# EAGLE schematic MIDI Decoder (EAGLE 9.6.2)
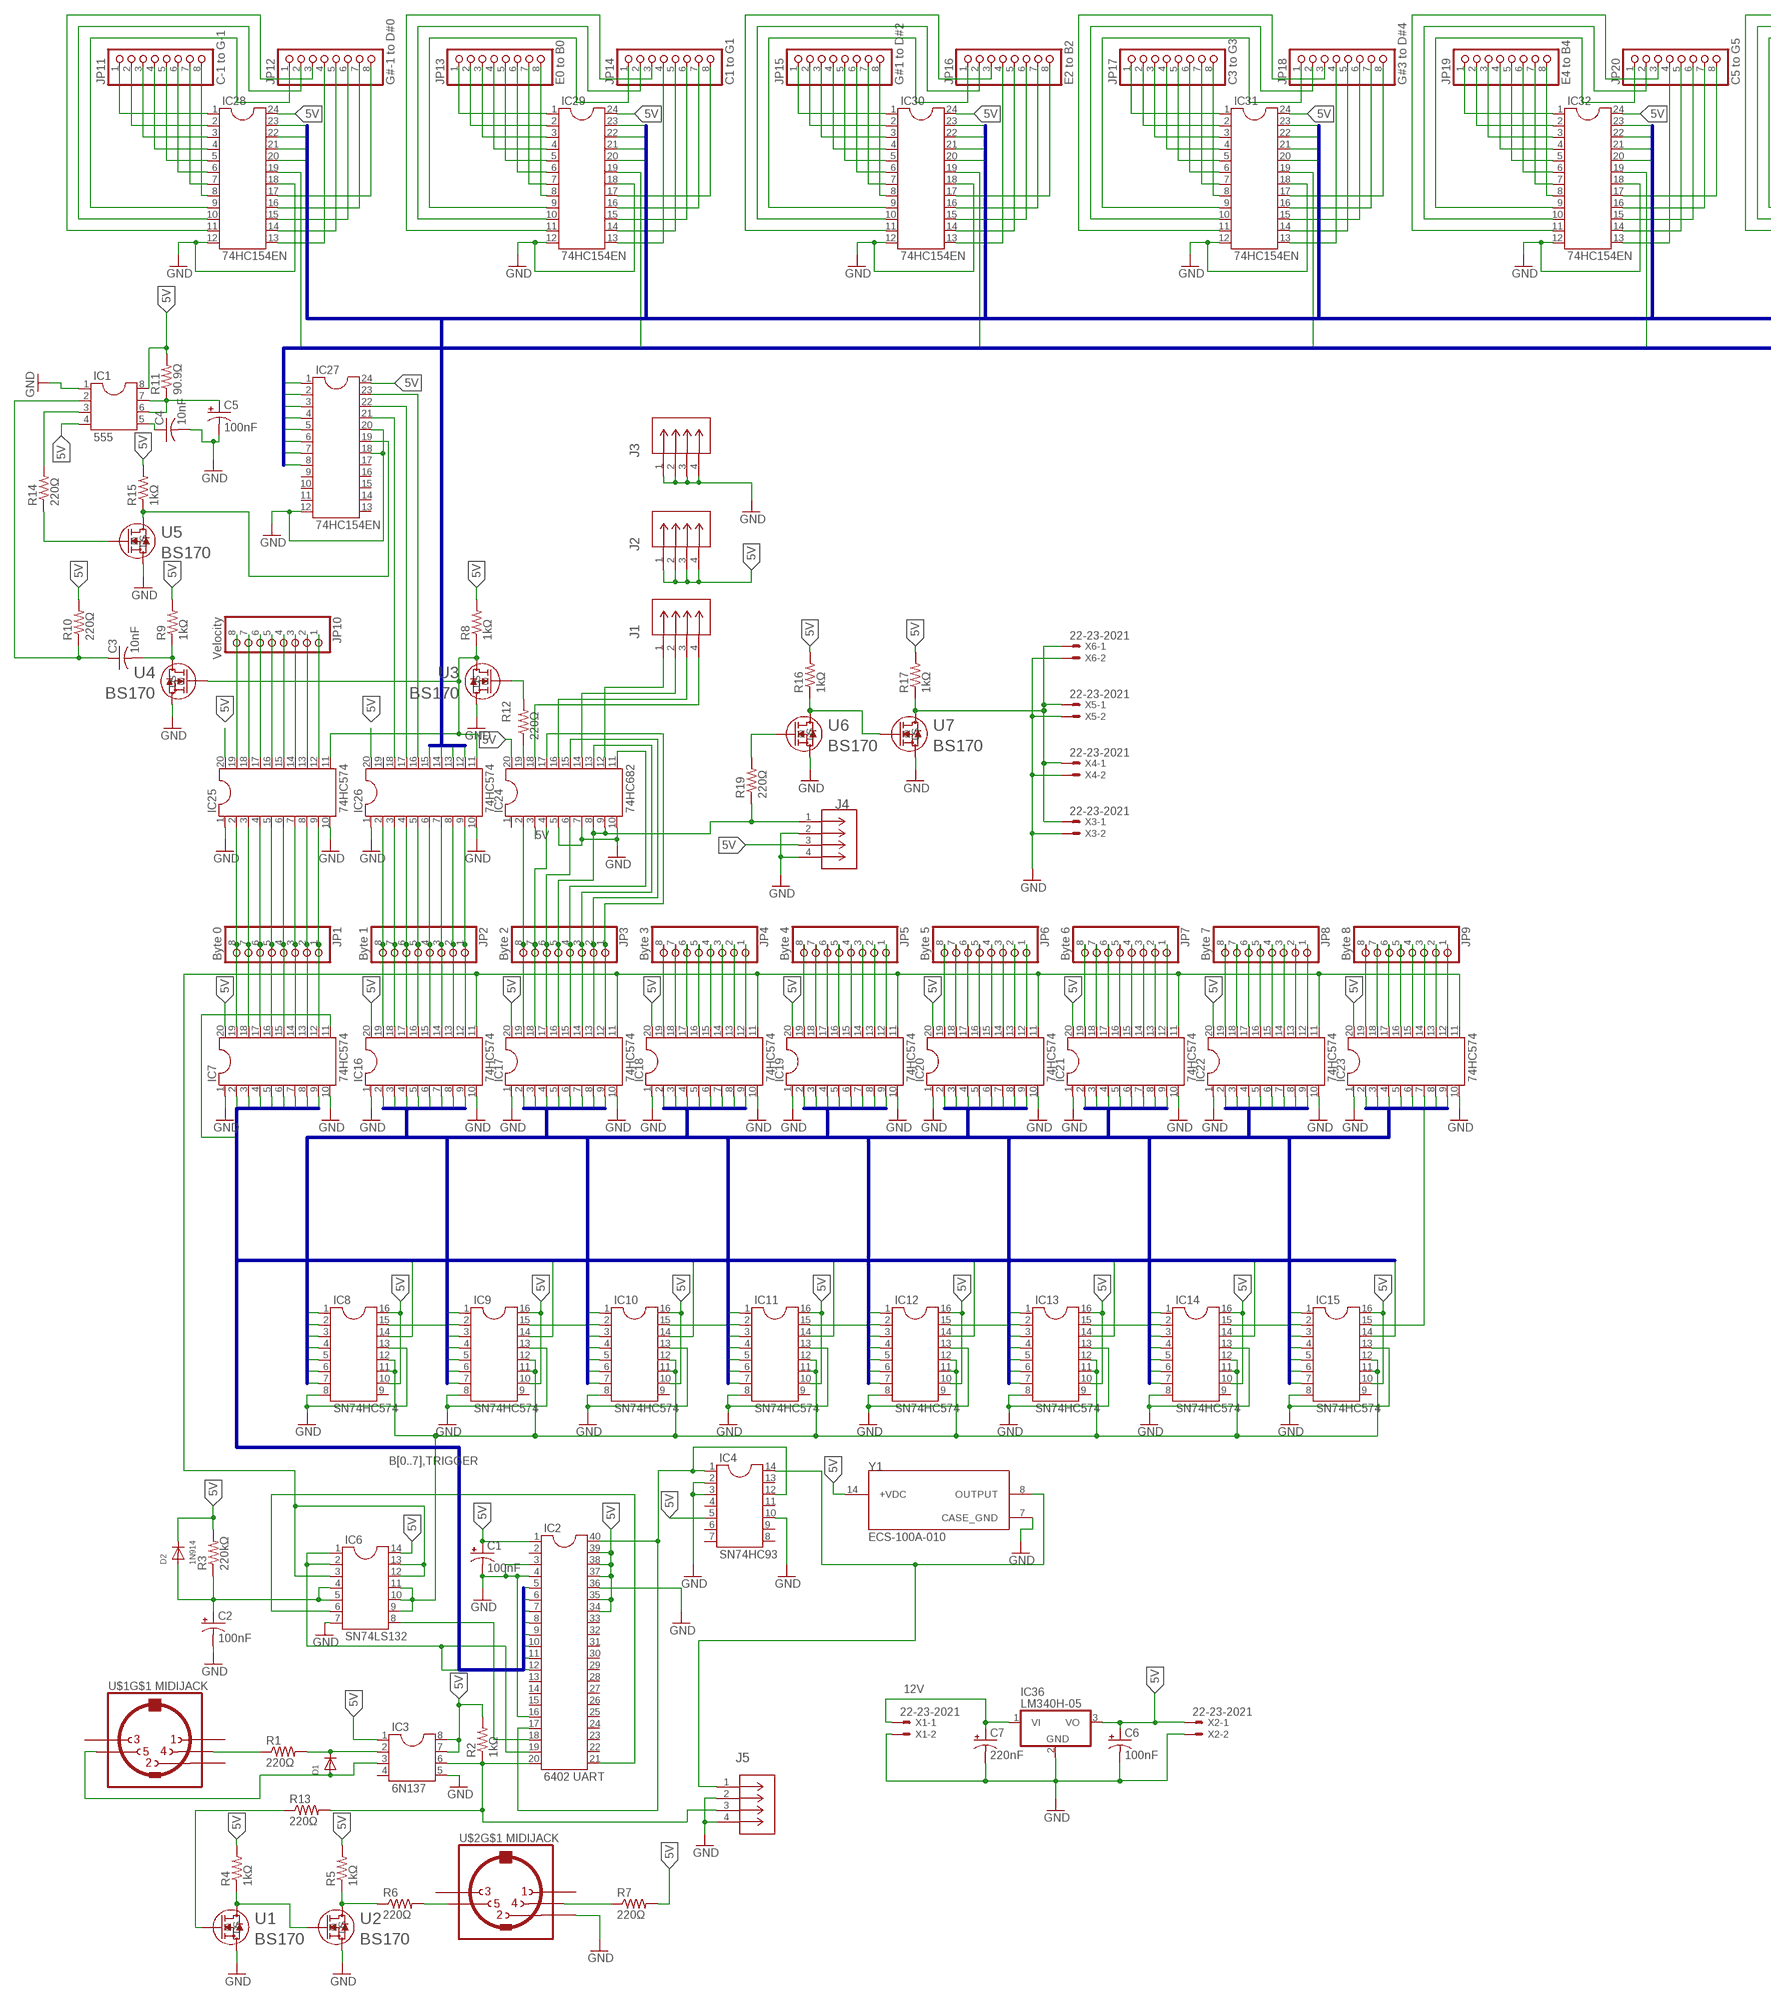
[diagram p0: schematic, sheet 1, part 1 of 2]
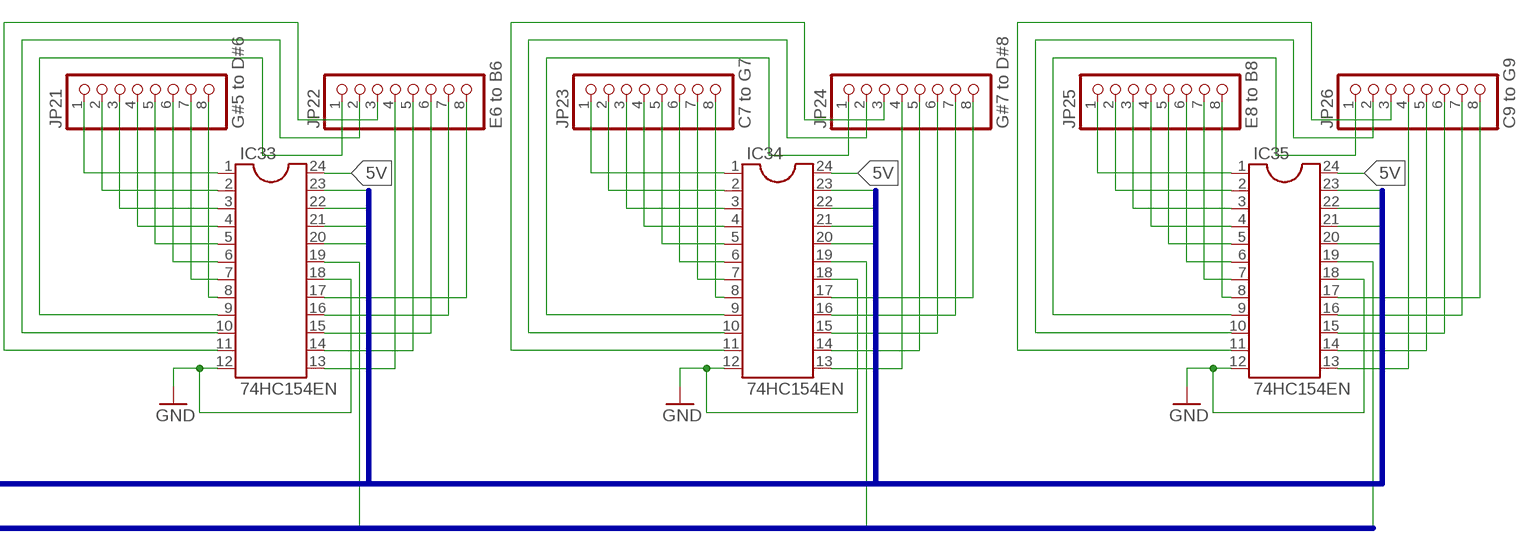
[diagram p1: schematic, sheet 1, part 2 of 2]

## Parts
C1  100nF  CPOL-USE1.8-4  [E1,8-4]
C2  100nF  CPOL-USE1.8-4  [E1,8-4]
C3  10nF  C-US050-025X075  [C050-025X075]
C4  10nF  C-US050-025X075  [C050-025X075]
C5  100nF  CPOL-USE1.8-4  [E1,8-4]
C6  100nF  CPOL-USE1.8-4  [E1,8-4]
C7  220nF  CPOL-USE2-5  [E2-5]
D1  DIODEDO-1N4148  [DO-1N4148]
D2  1N914  DIODEDO-1N4148  [DO-1N4148]
IC1  555  DIL8S  [SOCKET-08]
IC2  6402 UART  DIL40S  [SOCKET-40]
IC3  6N137  DIL8S  [SOCKET-08]
IC4  SN74HC93  DIL14S  [SOCKET-14]
IC6  SN74LS132  DIL14S  [SOCKET-14]
IC7  74HC574  DIL20S  [SOCKET-20]
IC8  SN74HC574  DIL16S  [SOCKET-16]
IC9  SN74HC574  DIL16S  [SOCKET-16]
IC10  SN74HC574  DIL16S  [SOCKET-16]
IC11  SN74HC574  DIL16S  [SOCKET-16]
IC12  SN74HC574  DIL16S  [SOCKET-16]
IC13  SN74HC574  DIL16S  [SOCKET-16]
IC14  SN74HC574  DIL16S  [SOCKET-16]
IC15  SN74HC574  DIL16S  [SOCKET-16]
IC16  74HC574  DIL20S  [SOCKET-20]
IC17  74HC574  DIL20S  [SOCKET-20]
IC18  74HC574  DIL20S  [SOCKET-20]
IC19  74HC574  DIL20S  [SOCKET-20]
IC20  74HC574  DIL20S  [SOCKET-20]
IC21  74HC574  DIL20S  [SOCKET-20]
IC22  74HC574  DIL20S  [SOCKET-20]
IC23  74HC574  DIL20S  [SOCKET-20]
IC24  74HC682  DIL20S  [SOCKET-20]
IC25  74HC574  DIL20S  [SOCKET-20]
IC26  74HC574  DIL20S  [SOCKET-20]
IC27  74HC154EN  DIL24S-3  [SOCKET-24S]
IC28  74HC154EN  DIL24S-3  [SOCKET-24S]
IC29  74HC154EN  DIL24S-3  [SOCKET-24S]
IC30  74HC154EN  DIL24S-3  [SOCKET-24S]
IC31  74HC154EN  DIL24S-3  [SOCKET-24S]
IC32  74HC154EN  DIL24S-3  [SOCKET-24S]
IC33  74HC154EN  DIL24S-3  [SOCKET-24S]
IC34  74HC154EN  DIL24S-3  [SOCKET-24S]
IC35  74HC154EN  DIL24S-3  [SOCKET-24S]
IC36  LM340H-05  [TO220H]
J1  61300411121  [CONN_61300411121_WRE]
J2  61300411121  [CONN_61300411121_WRE]
J3  61300411121  [CONN_61300411121_WRE]
J4  61300411121  [CONN_61300411121_WRE]
J5  61300411121  [CONN_61300411121_WRE]
JP1  Byte 0  PINHD-1X8BIG  [1X08-BIG]
JP2  Byte 1  PINHD-1X8BIG  [1X08-BIG]
JP3  Byte 2  PINHD-1X8BIG  [1X08-BIG]
JP4  Byte 3  PINHD-1X8BIG  [1X08-BIG]
JP5  Byte 4  PINHD-1X8BIG  [1X08-BIG]
JP6  Byte 5  PINHD-1X8BIG  [1X08-BIG]
JP7  Byte 6  PINHD-1X8BIG  [1X08-BIG]
JP8  Byte 7  PINHD-1X8BIG  [1X08-BIG]
JP9  Byte 8  PINHD-1X8BIG  [1X08-BIG]
JP10  Velocity  PINHD-1X8BIG  [1X08-BIG]
JP11  C-1 to G-1  PINHD-1X8BIG  [1X08-BIG]
JP12  G#-1 to D#0  PINHD-1X8BIG  [1X08-BIG]
JP13  E0 to B0  PINHD-1X8BIG  [1X08-BIG]
JP14  C1 to G1  PINHD-1X8BIG  [1X08-BIG]
JP15  G#1 to D#2  PINHD-1X8BIG  [1X08-BIG]
JP16  E2 to B2  PINHD-1X8BIG  [1X08-BIG]
JP17  C3 to G3  PINHD-1X8BIG  [1X08-BIG]
JP18  G#3 to D#4  PINHD-1X8BIG  [1X08-BIG]
JP19  E4 to B4  PINHD-1X8BIG  [1X08-BIG]
JP20  C5 to G5  PINHD-1X8BIG  [1X08-BIG]
JP21  G#5 to D#6  PINHD-1X8BIG  [1X08-BIG]
JP22  E6 to B6  PINHD-1X8BIG  [1X08-BIG]
JP23  C7 to G7  PINHD-1X8BIG  [1X08-BIG]
JP24  G#7 to D#8  PINHD-1X8BIG  [1X08-BIG]
JP25  E8 to B8  PINHD-1X8BIG  [1X08-BIG]
JP26  C9 to G9  PINHD-1X8BIG  [1X08-BIG]
R1  220Ω  R-US_0207/10  [0207/10]
R2  1kΩ  R-US_0207/10  [0207/10]
R3  220kΩ  R-US_0207/10  [0207/10]
R4  1kΩ  R-US_0207/10  [0207/10]
R5  1kΩ  R-US_0207/10  [0207/10]
R6  220Ω  R-US_0207/10  [0207/10]
R7  220Ω  R-US_0207/10  [0207/10]
R8  1kΩ  R-US_0207/10  [0207/10]
R9  1kΩ  R-US_0207/10  [0207/10]
R10  220Ω  R-US_0207/10  [0207/10]
R11  90.9Ω  R-US_0207/10  [0207/10]
R12  220Ω  R-US_0207/10  [0207/10]
R13  220Ω  R-US_0207/10  [0207/10]
R14  220Ω  R-US_0207/10  [0207/10]
R15  1kΩ  R-US_0207/10  [0207/10]
R16  1kΩ  R-US_0207/10  [0207/10]
R17  1kΩ  R-US_0207/10  [0207/10]
R19  220Ω  R-US_0207/10  [0207/10]
U1  BS170  [TO_SA06_ONS]
U2  BS170  [TO_SA06_ONS]
U3  BS170  [TO_SA06_ONS]
U4  BS170  [TO_SA06_ONS]
U5  BS170  [TO_SA06_ONS]
U6  BS170  [TO_SA06_ONS]
U7  BS170  [TO_SA06_ONS]
U$1  MIDIJACK  [CP-2350]
U$2  MIDIJACK  [CP-2350]
X1  22-23-2021  [22-23-2021]
X2  22-23-2021  [22-23-2021]
X3  22-23-2021  [22-23-2021]
X4  22-23-2021  [22-23-2021]
X5  22-23-2021  [22-23-2021]
X6  22-23-2021  [22-23-2021]
Y1  ECS-100A-010  [OSC_ECS-100A-010]

## Nets
5V: C1.+ C6.+ D2.C IC1.4 IC1.8 IC2.1 IC2.34 IC2.35 IC2.37 IC2.38 IC2.39 IC3.1 IC3.7 IC3.8 IC4.5 IC6.14 IC7.20 IC8.10 IC8.16 IC9.10 IC9.16 IC10.10 IC10.16 IC11.10 IC11.16 IC12.10 IC12.16 IC13.10 IC13.16 IC14.10 IC14.16 IC15.10 IC15.16 IC16.20 IC17.20 IC18.20 IC19.20 IC20.20 IC21.20 IC22.20 IC23.20 IC24.3 IC24.20 IC25.20 IC26.20 IC27.24 IC28.24 IC29.24 IC30.24 IC31.24 IC32.24 IC33.24 IC34.24 IC35.24 IC36.3(VO) J2.1 J2.2 J2.3 J2.4 J4.3 R2.2 R3.2 R4.2 R5.2 R7.2 R8.2 R9.2 R10.2 R11.2 R15.2 R16.2 R17.2 X2.1 Y1.14(+VDC)
12V: C7.+ IC36.1(VI) X1.1
B0: IC2.5 IC7.2 IC8.14
B1: IC2.6 IC7.3 IC9.14
B2: IC2.7 IC7.4 IC10.14
B3: IC2.8 IC7.5 IC11.14
B4: IC2.9 IC7.6 IC12.14
B5: IC2.10 IC7.7 IC13.14
B6: IC2.11 IC7.8 IC14.14
B7: IC2.12 IC7.9 IC15.14
CHS0: IC27.1 IC28.19
CHS1: IC27.2 IC29.19
CHS2: IC27.3 IC30.19
CHS3: IC27.4 IC31.19
CHS4: IC27.5 IC32.19
CHS5: IC27.6 IC33.19
CHS6: IC27.7 IC34.19
CHS7: IC27.8 IC35.19
GND: C1.- C2.- C4.2 C5.- C6.- C7.- IC1.1 IC2.3 IC2.4 IC2.16 IC2.36 IC3.5 IC4.2 IC4.3 IC4.10 IC6.7 IC7.1 IC7.10 IC8.8 IC8.13 IC9.8 IC9.13 IC10.8 IC10.13 IC11.8 IC11.13 IC12.8 IC12.13 IC13.8 IC13.13 IC14.8 IC14.13 IC15.8 IC15.13 IC16.1 IC16.10 IC17.1 IC17.10 IC18.1 IC18.10 IC19.1 IC19.10 IC20.1 IC20.10 IC21.1 IC21.10 IC22.1 IC22.10 IC23.1 IC23.10 IC24.5 IC24.7 IC24.10 IC25.1 IC25.10 IC26.1 IC26.10 IC27.12 IC27.18 IC27.20 IC28.12 IC28.18 IC29.12 IC29.18 IC30.12 IC30.18 IC31.12 IC31.18 IC32.12 IC32.18 IC33.12 IC33.18 IC34.12 IC34.18 IC35.12 IC35.18 IC36.2(GND) J3.1 J3.2 J3.3 J3.4 J4.2 J4.4 J5.2 J5.4 U1.3(S) U2.3(S) U3.3(S) U4.3(S) U5.3(S) U6.3(S) U7.3(S) U$2.2 X1.2 X2.2 X3.2 X4.2 X5.2 X6.2 Y1.7(CASE_GND)
N$1: D1.A IC3.3 U$1.5
N$2: D1.C IC3.2 R1.2
N$3: IC2.20 IC3.6 J5.3 R2.1 R13.2
N$4: R1.1 U$1.4
N$5: IC2.17 IC2.40 IC4.1 IC4.12
N$6: C3.1 IC1.2 R10.1
N$7: C5.+ IC1.6 IC1.7 R11.1
N$8: IC4.14 J5.1 Y1.8(OUTPUT)
N$9: IC24.19 R12.1
N$10: R4.1 U1.1(D) U2.2(G)
N$11: C4.1 IC1.5
N$12: IC7.19 IC25.2 JP1.8
N$13: IC2.18 IC6.8
N$14: IC6.3 IC6.12 IC6.13 IC16.11 IC17.11 IC18.11 IC19.11 IC20.11 IC21.11 IC22.11 IC23.11
N$15: IC1.3 R14.2
N$16: IC2.21 IC6.6
N$17: C2.+ D2.A IC6.4 IC6.5 R3.1
N$18: R14.1 U5.2(G)
N$19: R6.2 U$2.5
N$20: R5.1 R6.1 U2.1(D)
N$21: R7.1 U$2.4
N$22: R13.1 U1.2(G)
N$23: IC24.12 J1.1
N$25: R16.1 U6.1(D) U7.2(G)
N$26: IC27.19 R15.1 U5.1(D)
N$27: R17.1 U7.1(D) X3.1 X4.1 X5.1 X6.1
N$29: R19.2 U6.2(G)
N$33: IC6.9 IC6.10 IC6.11 IC8.11 IC8.12 IC9.11 IC9.12 IC10.11 IC10.12 IC11.11 IC11.12 IC12.11 IC12.12 IC13.11 IC13.12 IC14.11 IC14.12 IC15.11 IC15.12
N$42: IC7.18 IC25.3 JP1.7
N$43: IC7.17 IC25.4 JP1.6
N$44: IC7.16 IC25.5 JP1.5
N$45: IC7.15 IC25.6 JP1.4
N$46: IC7.14 IC25.7 JP1.3
N$47: IC7.13 IC25.8 JP1.2
N$48: IC7.12 IC25.9 JP1.1
N$49: IC16.19 IC26.2 JP2.8
N$50: IC16.18 IC26.3 JP2.7
N$51: IC16.17 IC26.4 JP2.6
N$52: IC16.16 IC26.5 JP2.5
N$53: IC16.15 IC26.6 JP2.4
N$54: IC16.14 IC26.7 JP2.3
N$55: IC16.13 IC26.8 JP2.2
N$56: IC16.12 IC26.9 JP2.1
N$57: IC24.14 J1.2
N$58: IC24.16 J1.3
N$59: IC24.18 J1.4
N$60: R12.2 U3.2(G)
N$61: IC25.11 IC26.11 R8.1 U3.1(D) U4.2(G)
N$62: IC25.19 JP10.8
N$63: C3.2 R9.1 U4.1(D)
N$64: IC25.18 JP10.7
N$65: IC18.19 JP4.8
N$66: IC18.18 JP4.7
N$67: IC18.17 JP4.6
N$68: IC18.16 JP4.5
N$69: IC18.15 JP4.4
N$70: IC18.14 JP4.3
N$71: IC18.13 JP4.2
N$72: IC18.12 JP4.1
N$73: IC19.19 JP5.8
N$74: IC19.18 JP5.7
N$75: IC19.17 JP5.6
N$76: IC19.16 JP5.5
N$77: IC19.15 JP5.4
N$78: IC19.14 JP5.3
N$79: IC19.13 JP5.2
N$80: IC19.12 JP5.1
N$81: IC20.19 JP6.8
N$82: IC20.18 JP6.7
N$83: IC20.17 JP6.6
N$84: IC20.16 JP6.5
N$85: IC20.15 JP6.4
N$86: IC20.14 JP6.3
N$87: IC20.13 JP6.2
N$88: IC20.12 JP6.1
N$89: IC21.19 JP7.8
N$90: IC21.18 JP7.7
N$91: IC21.17 JP7.6
N$92: IC21.16 JP7.5
N$93: IC21.15 JP7.4
N$94: IC21.14 JP7.3
N$95: IC21.13 JP7.2
N$96: IC21.12 JP7.1
N$97: IC22.19 JP8.8
N$98: IC22.18 JP8.7
N$99: IC22.17 JP8.6
N$100: IC22.16 JP8.5
N$101: IC22.15 JP8.4
N$102: IC22.14 JP8.3
N$103: IC22.13 JP8.2
N$104: IC22.12 JP8.1
N$105: IC23.19 JP9.8
N$106: IC23.18 JP9.7
N$107: IC23.17 JP9.6
N$108: IC23.16 JP9.5
N$109: IC23.15 JP9.4
N$110: IC23.14 JP9.3
N$111: IC23.13 JP9.2
N$112: IC23.12 JP9.1
N$113: IC25.17 JP10.6
N$114: IC25.16 JP10.5
N$115: IC25.15 JP10.4
N$116: IC25.14 JP10.3
N$117: IC25.13 JP10.2
N$118: IC25.12 JP10.1
N$119: IC26.18 IC27.21
N$120: IC26.17 IC27.22
N$121: IC26.16 IC27.23
N$122: IC28.1 JP11.1
N$123: IC28.2 JP11.2
N$124: IC28.3 JP11.3
N$125: IC28.4 JP11.4
N$126: IC28.5 JP11.5
N$127: IC28.6 JP11.6
N$128: IC28.7 JP11.7
N$129: IC28.8 JP11.8
N$130: IC28.9 JP12.1
N$131: IC28.10 JP12.2
N$132: IC28.11 JP12.3
N$133: IC28.13 JP12.4
N$134: IC28.14 JP12.5
N$135: IC28.15 JP12.6
N$136: IC28.16 JP12.7
N$137: IC28.17 JP12.8
N$138: IC29.1 JP13.1
N$139: IC29.2 JP13.2
N$140: IC29.3 JP13.3
N$141: IC29.4 JP13.4
N$142: IC29.5 JP13.5
N$143: IC29.6 JP13.6
N$144: IC29.7 JP13.7
N$145: IC29.8 JP13.8
N$146: IC29.9 JP14.1
N$147: IC29.10 JP14.2
N$148: IC29.11 JP14.3
N$149: IC29.13 JP14.4
N$150: IC29.14 JP14.5
N$151: IC29.15 JP14.6
N$152: IC29.16 JP14.7
N$153: IC29.17 JP14.8
N$154: IC30.1 JP15.1
N$155: IC30.2 JP15.2
N$156: IC30.3 JP15.3
N$157: IC30.4 JP15.4
N$158: IC30.5 JP15.5
N$159: IC30.6 JP15.6
N$160: IC30.7 JP15.7
N$161: IC30.8 JP15.8
N$162: IC30.9 JP16.1
N$163: IC30.10 JP16.2
N$164: IC30.11 JP16.3
N$165: IC30.13 JP16.4
N$166: IC30.14 JP16.5
N$167: IC30.15 JP16.6
N$168: IC30.16 JP16.7
N$169: IC30.17 JP16.8
N$170: IC31.1 JP17.1
N$171: IC31.2 JP17.2
N$172: IC31.3 JP17.3
N$173: IC31.4 JP17.4
N$174: IC31.5 JP17.5
N$175: IC31.6 JP17.6
N$176: IC31.7 JP17.7
N$177: IC31.8 JP17.8
N$178: IC31.9 JP18.1
N$179: IC31.10 JP18.2
N$180: IC31.11 JP18.3
N$181: IC31.13 JP18.4
N$182: IC31.14 JP18.5
N$183: IC31.15 JP18.6
N$184: IC31.16 JP18.7
N$185: IC31.17 JP18.8
N$186: IC32.1 JP19.1
N$187: IC32.2 JP19.2
N$188: IC32.3 JP19.3
N$189: IC32.4 JP19.4
N$190: IC32.5 JP19.5
N$191: IC32.6 JP19.6
N$192: IC32.7 JP19.7
N$193: IC32.8 JP19.8
N$194: IC32.9 JP20.1
N$195: IC32.10 JP20.2
N$196: IC32.11 JP20.3
N$197: IC32.13 JP20.4
N$198: IC32.14 JP20.5
N$199: IC32.15 JP20.6
N$200: IC32.16 JP20.7
N$201: IC32.17 JP20.8
N$202: IC33.1 JP21.1
N$203: IC33.2 JP21.2
N$204: IC33.3 JP21.3
N$205: IC33.4 JP21.4
N$206: IC33.5 JP21.5
N$207: IC33.6 JP21.6
N$208: IC33.7 JP21.7
N$209: IC33.8 JP21.8
N$210: IC33.9 JP22.1
N$211: IC33.10 JP22.2
N$212: IC33.11 JP22.3
N$213: IC33.13 JP22.4
N$214: IC33.14 JP22.5
N$215: IC33.15 JP22.6
N$216: IC33.16 JP22.7
N$217: IC33.17 JP22.8
N$218: IC34.1 JP23.1
N$219: IC34.2 JP23.2
N$220: IC34.3 JP23.3
N$221: IC34.4 JP23.4
N$222: IC34.5 JP23.5
N$223: IC34.6 JP23.6
N$224: IC34.7 JP23.7
N$225: IC34.8 JP23.8
N$226: IC34.9 JP24.1
N$227: IC34.10 JP24.2
N$228: IC34.11 JP24.3
N$229: IC34.13 JP24.4
N$230: IC34.14 JP24.5
N$231: IC34.15 JP24.6
N$232: IC34.16 JP24.7
N$233: IC34.17 JP24.8
N$234: IC35.1 JP25.1
N$235: IC35.2 JP25.2
N$236: IC35.3 JP25.3
N$237: IC35.4 JP25.4
N$238: IC35.5 JP25.5
N$239: IC35.6 JP25.6
N$240: IC35.7 JP25.7
N$241: IC35.8 JP25.8
N$242: IC35.9 JP26.1
N$243: IC35.10 JP26.2
N$244: IC35.11 JP26.3
N$245: IC35.13 JP26.4
N$246: IC35.14 JP26.5
N$247: IC35.15 JP26.6
N$248: IC35.16 JP26.7
N$249: IC35.17 JP26.8
P0: IC17.19 IC24.2 JP3.8
P1: IC17.18 IC24.4 JP3.7
P2: IC17.17 IC24.6 JP3.6
P3: IC17.16 IC24.8 IC24.9 J4.1 JP3.5 R19.1
P4: IC17.15 IC24.11 JP3.4
P5: IC17.14 IC24.13 JP3.3
P6: IC17.13 IC24.15 JP3.2
P7: IC17.12 IC24.17 JP3.1
S0: IC26.12 IC28.23 IC29.23 IC30.23 IC31.23 IC32.23 IC33.23 IC34.23 IC35.23
S1: IC26.13 IC28.22 IC29.22 IC30.22 IC31.22 IC32.22 IC33.22 IC34.22 IC35.22
S2: IC26.14 IC28.21 IC29.21 IC30.21 IC31.21 IC32.21 IC33.21 IC34.21 IC35.21
S3: IC26.15 IC28.20 IC29.20 IC30.20 IC31.20 IC32.20 IC33.20 IC34.20 IC35.20
T-1-0: IC8.15 IC16.2
T-1-1: IC9.15 IC16.3
T-1-2: IC10.15 IC16.4
T-1-3: IC11.15 IC16.5
T-1-4: IC12.15 IC16.6
T-1-5: IC13.15 IC16.7
T-1-6: IC14.15 IC16.8
T-1-7: IC15.15 IC16.9
T-2-0: IC8.1 IC17.2
T-2-1: IC9.1 IC17.3
T-2-2: IC10.1 IC17.4
T-2-3: IC11.1 IC17.5
T-2-4: IC12.1 IC17.6
T-2-5: IC13.1 IC17.7
T-2-6: IC14.1 IC17.8
T-2-7: IC15.1 IC17.9
T-3-0: IC8.2 IC18.2
T-3-1: IC9.2 IC18.3
T-3-2: IC10.2 IC18.4
T-3-3: IC11.2 IC18.5
T-3-4: IC12.2 IC18.6
T-3-5: IC13.2 IC18.7
T-3-6: IC14.2 IC18.8
T-3-7: IC15.2 IC18.9
T-4-0: IC8.3 IC19.2
T-4-1: IC9.3 IC19.3
T-4-2: IC10.3 IC19.4
T-4-3: IC11.3 IC19.5
T-4-4: IC12.3 IC19.6
T-4-5: IC13.3 IC19.7
T-4-6: IC14.3 IC19.8
T-4-7: IC15.3 IC19.9
T-5-0: IC8.4 IC20.2
T-5-1: IC9.4 IC20.3
T-5-2: IC10.4 IC20.4
T-5-3: IC11.4 IC20.5
T-5-4: IC12.4 IC20.6
T-5-5: IC13.4 IC20.7
T-5-6: IC14.4 IC20.8
T-5-7: IC15.4 IC20.9
T-6-0: IC8.5 IC21.2
T-6-1: IC9.5 IC21.3
T-6-2: IC10.5 IC21.4
T-6-3: IC11.5 IC21.5
T-6-4: IC12.5 IC21.6
T-6-5: IC13.5 IC21.7
T-6-6: IC14.5 IC21.8
T-6-7: IC15.5 IC21.9
T-7-0: IC8.6 IC22.2
T-7-1: IC9.6 IC22.3
T-7-2: IC10.6 IC22.4
T-7-3: IC11.6 IC22.5
T-7-4: IC12.6 IC22.6
T-7-5: IC13.6 IC22.7
T-7-6: IC14.6 IC22.8
T-7-7: IC15.6 IC22.9
T-8-0: IC8.7 IC23.2
T-8-1: IC9.7 IC23.3
T-8-2: IC10.7 IC23.4
T-8-3: IC11.7 IC23.5
T-8-4: IC12.7 IC23.6
T-8-5: IC13.7 IC23.7
T-8-6: IC14.7 IC23.8
T-8-7: IC15.7 IC23.9
TRIGGER: IC2.19 IC6.1 IC6.2 IC7.11
Unconnected: IC2.2 IC2.13 IC2.14 IC2.15 IC2.22 IC2.23 IC2.24 IC2.25 IC2.26 IC2.27 IC2.28 IC2.29 IC2.30 IC2.31 IC2.32 IC2.33 IC3.4 IC4.4 IC4.6 IC4.7 IC4.8 IC4.9 IC4.11 IC4.13 IC8.9 IC9.9 IC10.9 IC11.9 IC12.9 IC13.9 IC14.9 IC15.9 IC24.1 IC26.19 IC27.9 IC27.10 IC27.11 IC27.13 IC27.14 IC27.15 IC27.16 IC27.17 U$1.1 U$1.2 U$1.3 U$1.PE1(MT) U$1.PE2(MT) U$1.PE(MT) U$1.PE@(MT) U$2.1 U$2.3 U$2.PE1(MT) U$2.PE2(MT) U$2.PE(MT) U$2.PE@(MT)

## Buses
B[0..7],TRIGGER
T-1-[0..7],T-2-[0..7],T-3-[0..7],T-4-[0..7],T-5-[0..7],T-6-[0..7],T-7-[0..7],T-8-[0..7]
CHS[0..7]
S[0..3]

## Library data of the parts
C1 C2 C5-C7 = adafruit:CPOL-US: POLARIZED CAPACITOR, American symbol
C3 C4 = adafruit:C-US: CAPACITOR, American symbol
D1 D2 = adafruit:DIODE: Diode SMADIODE - SMA Surface Mount Package 20V 1A Schottky Diode Digikey: 641-1014-6-ND DO-1N4148 - Through Hole Small Current Diode SOD-123 20V 1 A (.5mV Vf) Schottky Diode - Digikey: MBRX120TPMSCT-ND SOD-323 10V 570mA (.38mV Vf, 3ns) Schottky Diode - Digikey: ZLLS410CT-ND SOD-523 30V 30mA Schottky Diode (RB751S-40TE61) - Digikey: RB751S-40TE61CT-ND SOT23-R/W - SOT23 Package (R = Solder Paste/Reflow Ovens, W = Hand-Soldering) BAT54Film 40V 300mA - Digikey: 497-7162-1-ND
IC1 IC3 = ic-package:DIL8: Dual In Line / Socket
IC2 = ic-package-with-sockets:DIL40: Dual In Line
IC4 IC6 = ic-package:DIL14: Dual In Line / Socket
IC7 IC16-IC26 = ic-package:DIL20: Dual In Line / Socket
IC8-IC15 = ic-package:DIL16: Dual In Line / Socket
IC27-IC35 = ic-package-with-sockets:DIL24: Dual In Line
IC36 = linear:LM340?-*: Positive VOLTAGE REGULATOR Source: http://cache.national.com/ds/LM/LM340.pdf
J1-J5 = components:61300411121: 4x1 PIN HEADER; COPYRIGHT: Copyright (C) 2024 Ultra Librarian. All rights reserved.; MANUFACTURER_PART_NUMBER: 61300411121; MFR_NAME: Wurth Electronics
JP1-JP26 = adafruit:PINHD-1X8: PIN HEADER
R1-R17 R19 = adafruit:R-US_: RESISTOR, American symbol
U1-U7 = components:BS170: N-Channel enhancement type MOSFET; COPYRIGHT: Copyright (C) 2024 Ultra Librarian. All rights reserved.; MANUFACTURER_PART_NUMBER: BS170; MFR_NAME: onsemi / Fairchild Semiconductor
U$1 U$2 = adafruit:MIDIJACK: DIN 5 jack also known as MIDI jack A modification of conn-hirshman:MAB5SH with two options for the grounding 'teeth'
X1-X6 = con-molex:22-23-2021: .100" (2.54mm) Center Header - 2 Pin; MF: MOLEX; MPN: 22-23-2021; OC_FARNELL: 1462926; OC_NEWARK: 25C3832
Y1 = ECS-100A-010:ECS-100A-010: Oscillator 14-DIP, 4 Leads (Full Size, Metal Can); MANUFACTURER: ECS Inc.; STANDARD: MANUFACTURER RECOMMENDATIONS